# Altium schematic sheet MCU_F1.SchDoc
size A4
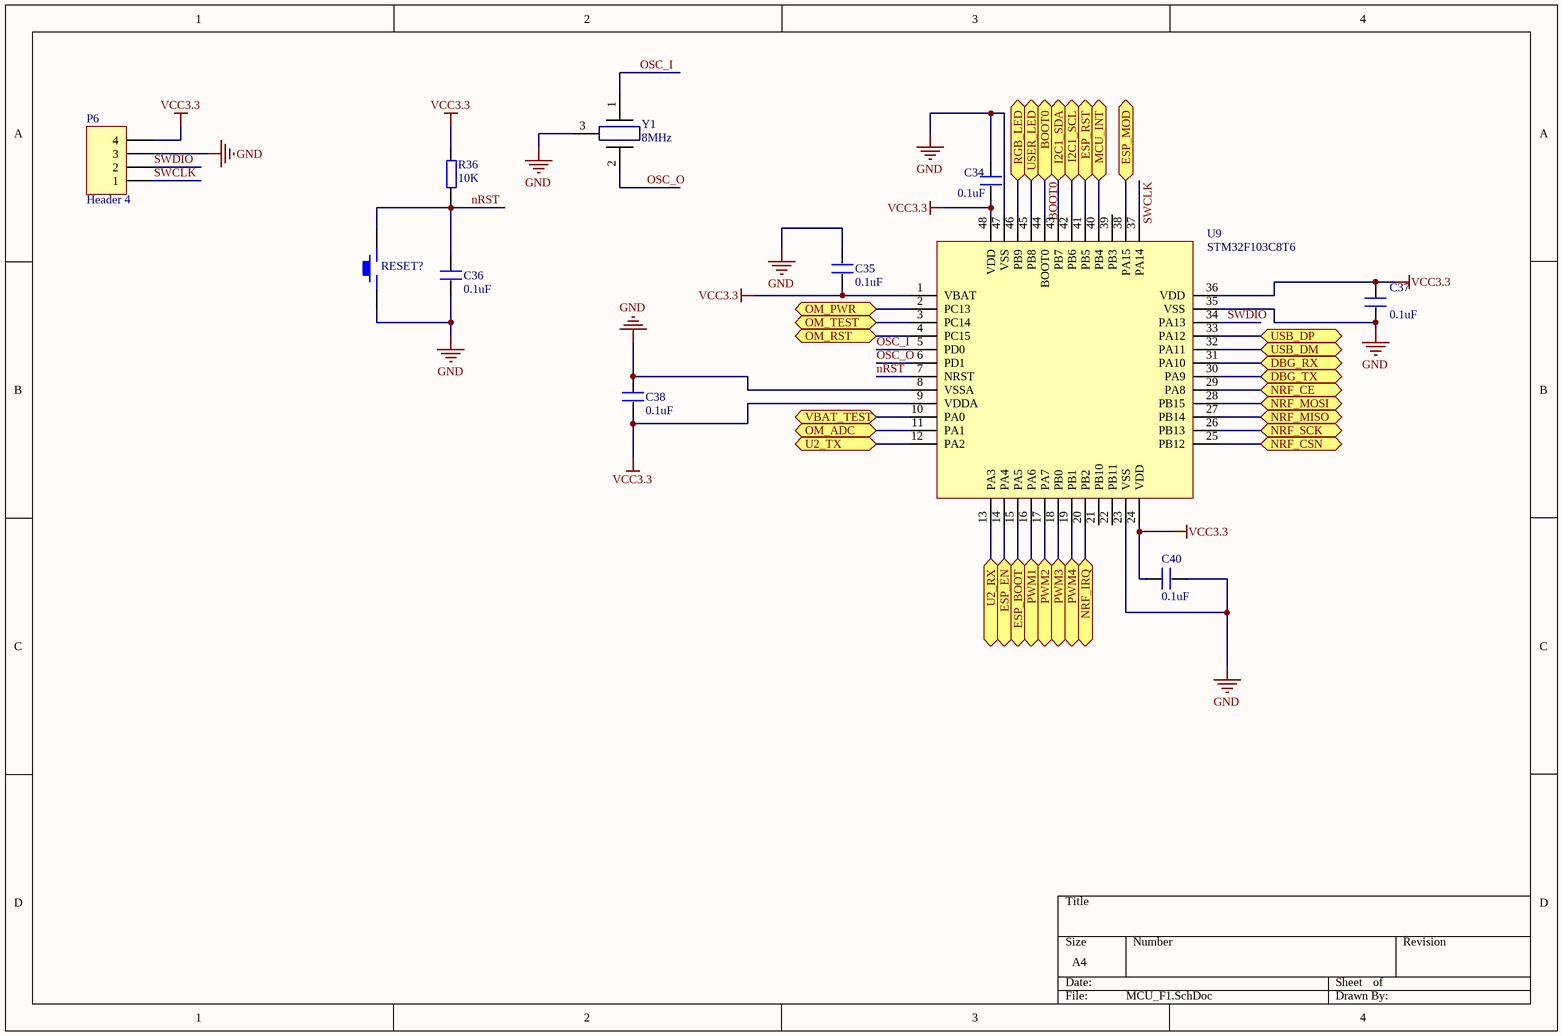
[diagram p0: MCU_F1.SchDoc]

## Parts
C34  0.1uF  [0603P]
C35  0.1uF  [0603P]
C36  0.1uF  [0603P]
C37  0.1uF  [0603P]
C38  0.1uF  [0603P]
C40  0.1uF  [0603P]
P6  Header 4  [HDR1X4]
R36  10K  [0603P]
RESET?  KEY_M  [KEY_M]  (value not drawn)
U9  STM32F103C8T6  [LQFP48 7X7]
Y1  value 8MHz  [SMD-cstse800G52-r0]  (hidden comment: XTAL)

## Ports
BOOT0, DBG_RX, DBG_TX, ESP_BOOT, ESP_EN, ESP_MOD, ESP_RST, I2C1_SCL, I2C1_SDA, MCU_INT, NRF_CE, NRF_CSN, NRF_IRQ, NRF_MISO, NRF_MOSI, NRF_SCK, OM_ADC, OM_PWR, OM_RST, OM_TEST, PWM1, PWM2, PWM3, PWM4, RGB_LED, U2_RX, U2_TX, USB_DM, USB_DP, USER_LED, VBAT_TEST

## Nets
GND: C34.1 C35.1 C36.2 C37.1 C38.1 C40.1 P6.3 RESET?.1 U9.8(VSSA) U9.23(VSS) U9.35(VSS) U9.47(VSS) Y1.3
VCC3.3: C34.2 C35.2 C37.2 C38.2 C40.2 P6.4 R36.2 U9.1(VBAT) U9.9(VDDA) U9.24(VDD) U9.36(VDD) U9.48(VDD)
BOOT0: U9.44(BOOT0) ; port BOOT0
DBG_RX: U9.31(PA10) ; port DBG_RX
DBG_TX: U9.30(PA9) ; port DBG_TX
ESP_BOOT: U9.15(PA5) ; port ESP_BOOT
ESP_EN: U9.14(PA4) ; port ESP_EN
ESP_MOD: U9.38(PA15) ; port ESP_MOD
ESP_RST: U9.41(PB5) ; port ESP_RST
I2C1_SCL: U9.42(PB6) ; port I2C1_SCL
I2C1_SDA: U9.43(PB7) ; port I2C1_SDA
MCU_INT: U9.40(PB4) ; port MCU_INT
NRF_CE: U9.29(PA8) ; port NRF_CE
NRF_CSN: U9.25(PB12) ; port NRF_CSN
NRF_IRQ: U9.20(PB2) ; port NRF_IRQ
NRF_MISO: U9.27(PB14) ; port NRF_MISO
NRF_MOSI: U9.28(PB15) ; port NRF_MOSI
NRF_SCK: U9.26(PB13) ; port NRF_SCK
nRST: C36.1 R36.1 RESET?.2 U9.7(NRST)
OM_ADC: U9.11(PA1) ; port OM_ADC
OM_PWR: U9.2(PC13) ; port OM_PWR
OM_RST: U9.4(PC15) ; port OM_RST
OM_TEST: U9.3(PC14) ; port OM_TEST
OSC_I: U9.5(PD0) Y1.1
OSC_O: U9.6(PD1) Y1.2
PWM1: U9.16(PA6) ; port PWM1
PWM2: U9.17(PA7) ; port PWM2
PWM3: U9.18(PB0) ; port PWM3
PWM4: U9.19(PB1) ; port PWM4
RGB_LED: U9.46(PB9) ; port RGB_LED
SWCLK: P6.1 U9.37(PA14)
SWDIO: P6.2 U9.34(PA13)
U2_RX: U9.13(PA3) ; port U2_RX
U2_TX: U9.12(PA2) ; port U2_TX
USB_DM: U9.32(PA11) ; port USB_DM
USB_DP: U9.33(PA12) ; port USB_DP
USER_LED: U9.45(PB8) ; port USER_LED
VBAT_TEST: U9.10(PA0) ; port VBAT_TEST

Not connected (* = marked no-connect by the designer): U9 21(PB10) 22(PB11) 39(PB3)

## Library data of the parts
C34-C38 C40 = C
P6 = Header 4: Header, 4-Pin; LatestRevisionDate: 17-Jul-2002; LatestRevisionNote: Re-released for DXP Platform.; Publisher: Altium Limited
R36 = R
Y1 = XTAL_2: Publisher: mazhongwei; Published: 8-August-2017; PackageReference: SMD-cstse800G52-r0